# EAGLE board DUE3DOM_MINI_23052016-1301 (EAGLE 7.5.0)
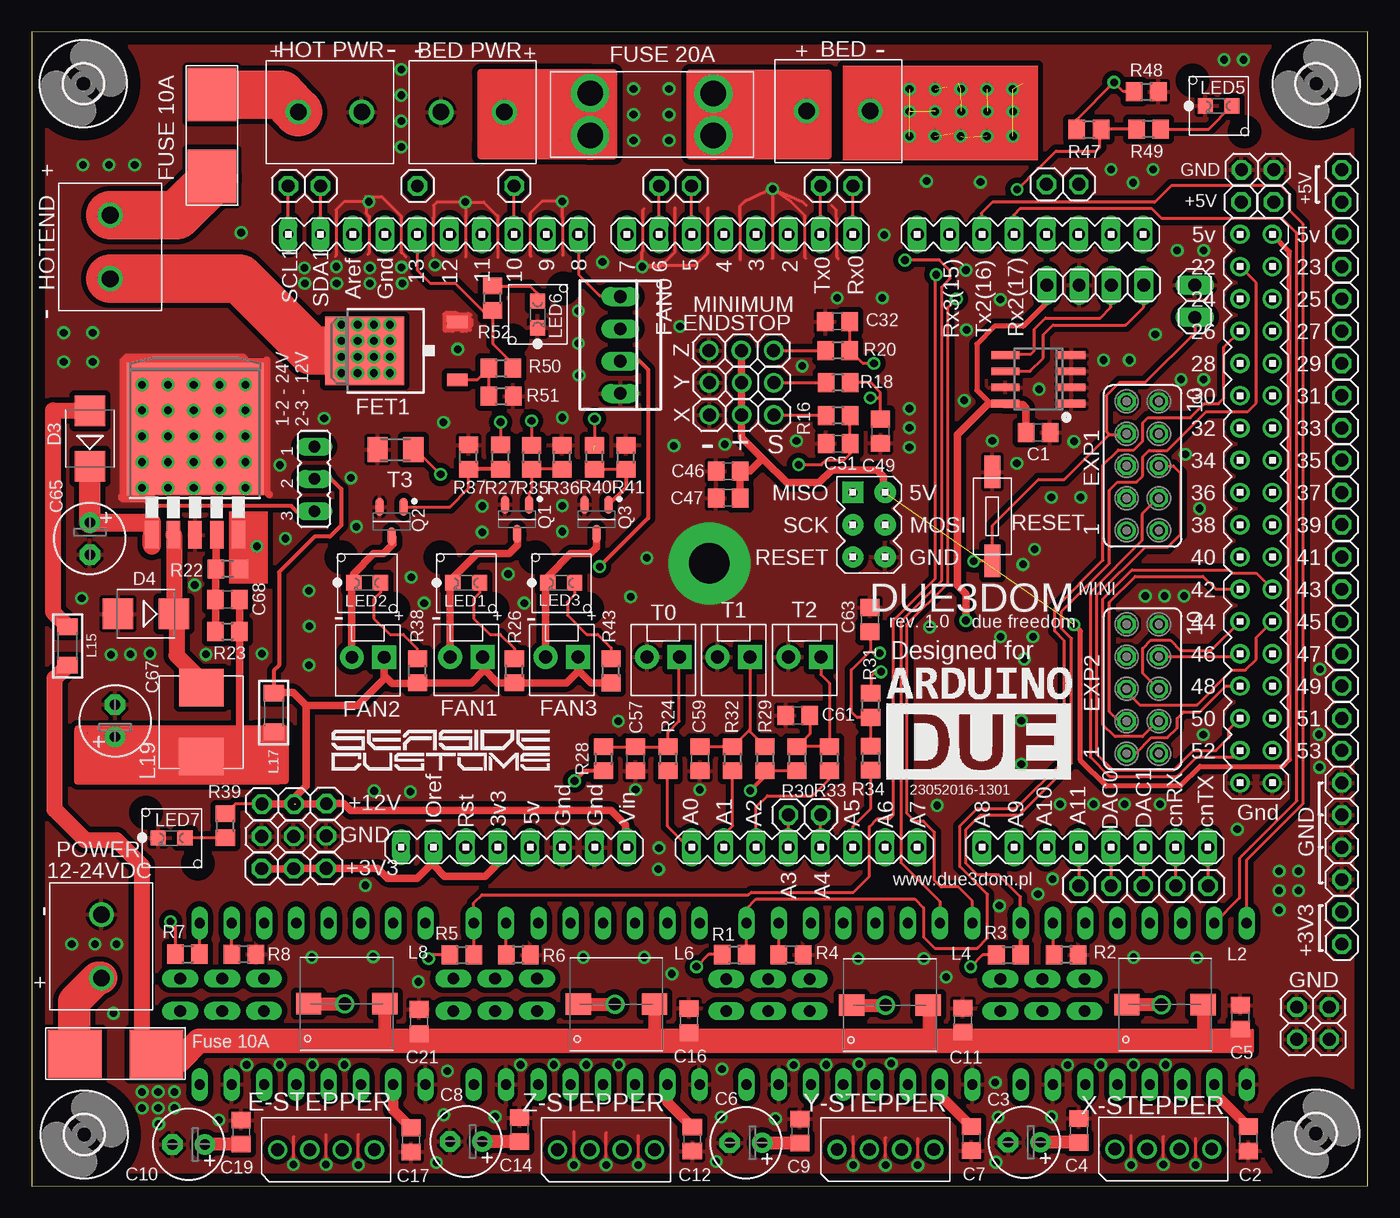
[diagram p3: board, top side]
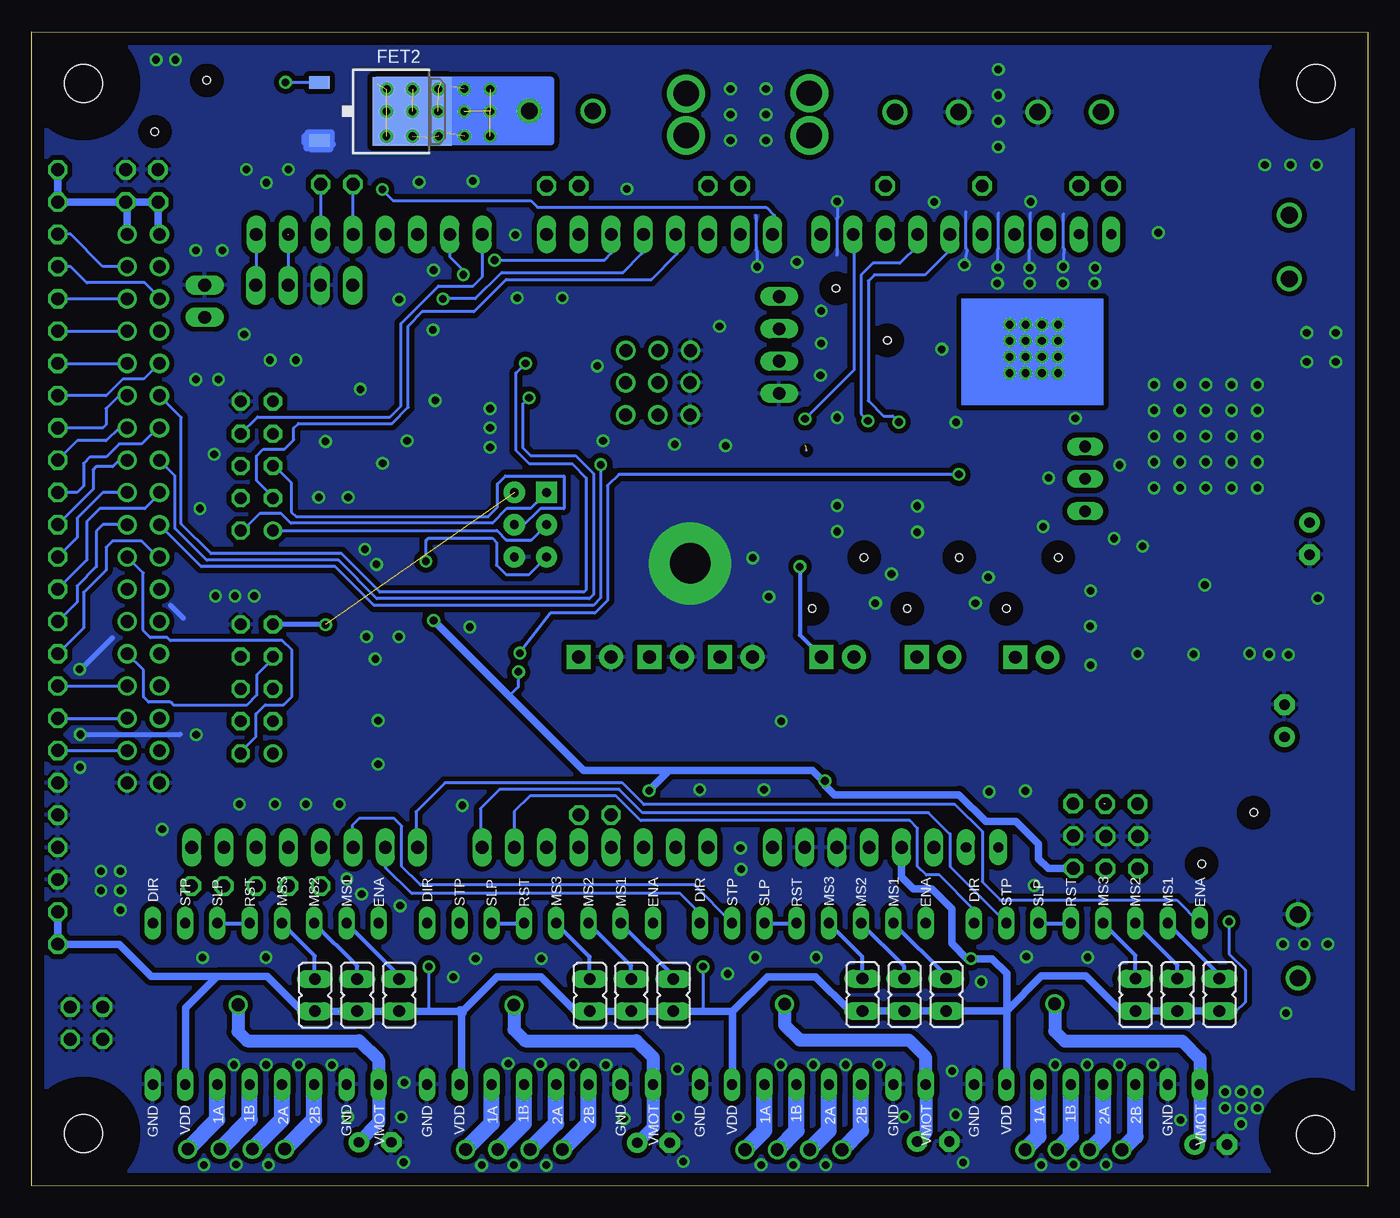
[diagram p4: board, bottom side, seen from below]

Size 105.17 x 90.88 mm. Coordinates in mm from the lower left corner, seen from the top.
Outline: 0,0 105.17,0.02 105.17,90.88 0,90.86 0,0
Copper layers (1*16): Top 0.035mm / dielectric 1.5mm / Bottom 0.035mm
Design rules "default *": minimum track width 10mil, minimum drill 23mil, track to track 8mil, track to pad 8mil, pad to pad 8mil, via to via 8mil, smd to smd 8mil, copper to edge 40mil, drill to drill 8mil, minimum pad ring 10mil, minimum via ring 8mil, stop-mask expansion 4mil, vias tented up to drill 24mil, thermal gap 10mil

## Footprints (pad centres in the part's own frame; a part is rotated, then mirrored left to right if it is on the bottom)
C0805 = smd 1.3 x 1.5: 1 -0.95,0; 2 0.95,0
E2,5-6 = drill 0.813 pad 1.6: + -1.27,0 | drill 0.813 pad 1.6 octagon: - 1.27,0
SMB = smd 2.4 x 2.4: A 2.2,0; C -2.2,0
DPAK_N-CHANNEL_MOSFET = smd 5.4 x 6.2: D 0,1.23 | smd 1 x 1.6: G -2.28,-6.07; S 2.28,-6.07
MOLEX-1X2 = drill 1.016 pad 1.88 square: 1 0,0 | drill 1.016 pad 1.88: 2 2.54,0
1X04 = drill 1.016 long: 1 -3.81,0; 2 -1.27,0; 3 1.27,0; 4 3.81,0
1X02 = drill 1.016 long: 1 -1.27,0; 2 1.27,0
3,0 = hole 3: 0,0
SO-08 = smd 0.6 x 2.2: 1 -1.905,-2.6; 2 -0.635,-2.6; 3 0.635,-2.6; 4 1.905,-2.6; 5 1.905,2.6; 6 0.635,2.6; 7 -0.635,2.6; 8 -1.905,2.6
TO263-5 = smd 1.067 x 2.159: 1 -3.404,-5.791; 2 -1.702,-5.791; 3 0,-5.791; 4 1.702,-5.791; 5 3.404,-5.791 | smd 10.8 x 10.41: 6 0,2.54
66100411622 = drill 1: 1 -5.08,0; 2 -2.54,0; 3 0,0; 4 2.54,0
1X01 = drill 1.016 octagon: 1 0,0
JP2 = drill 0.914 long: 1 -2.54,0; 2 0,0; 3 2.54,0
1X03 = drill 1.016: 1 -2.54,0; 2 0,0; 3 2.54,0
JP1 = drill 0.914 long: 1 0,-1.27; 2 0,1.27
WE-PD_7332/7345_PLASTIC_BASE = smd 1.7 x 2: 1 0,3; 2 0,-3
L1206 = smd 1.3 x 1.6: 1 -1.524,0; 2 1.524,0
WE-LHMI_7030/7050 = smd 2.95 x 3.5: 1 -2.725,0; 2 2.725,0
LED_0805_BIVAR_VLP-250-F = smd 1.2 x 1.2: A 0,-1.05; C 0,1.05 | hole 0.6: -2.032,-2.057; 2.007,2.032
691241710002 = drill 1.3: 1 -2.5,0; 2 2.5,0
SOT95P280X135-3N = smd 1.4 x 0.65: 1 -1.15,0.95; 2 -1.15,-0.95; 3 1.15,0
R0805 = smd 1.3 x 1.5: 1 -0.95,0; 2 0.95,0
WIDE_TACT = smd 2.54 x 1.27: 1 -3.5,0; 2 3.5,0
STEP-STICK = drill 0.8 long: 1A 3.81,-7.62; 1B 3.81,-5.08; 2A 3.81,-2.54; 2B 3.81,0; DIR -8.89,-12.7; ENABLE -8.89,5.08; GND 3.81,2.54; GND1 3.81,-12.7; MS1 -8.89,2.54; MS2 -8.89,0; MS3 -8.89,-2.54; RESET -8.89,-5.08; SLEEP -8.89,-7.62; STP -8.89,-10.16; VDD 3.81,-10.16; VMOT 3.81,5.08
FE05-2 = drill 0.914: 1 -5.08,1.27 | drill 0.914 octagon: 2 -5.08,-1.27; 3 -2.54,1.27; 4 -2.54,-1.27; 5 0,1.27; 6 0,-1.27; 7 2.54,1.27; 8 2.54,-1.27; 9 5.08,1.27; 10 5.08,-1.27
M1206 = smd 1.6 x 2: 1 -1.4,0; 2 1.4,0
DUE(NORMAL) = drill 1 long: 2 -16.51,30.48; 3 -19.05,30.48; 3V3 -39.37,-17.78; 4 -21.59,30.48; 5 -24.13,30.48; 5V -36.83,-17.78; 6 -26.67,30.48; 7 -29.21,30.48; 8 -33.02,30.48; 9 -35.56,30.48; 10 -38.1,30.48; 11 -40.64,30.48; 12 -43.18,30.48; 13 -45.72,30.48; A0 -24.13,-17.78; A1 -21.59,-17.78; A2 -19.05,-17.78; A3 -16.51,-17.78; A4 -13.97,-17.78; A5 -11.43,-17.78; A6 -8.89,-17.78; A7 -6.35,-17.78; A8 -1.27,-17.78; A9 1.27,-17.78; A10 3.81,-17.78; A11 6.35,-17.78; AREF -50.8,30.48; AREF1 -50.8,30.48; CANRX 13.97,-17.78; CANTX 16.51,-17.78; DAC0 8.89,-17.78; DAC1 11.43,-17.78; GND1 -48.26,30.48; GND_1 -34.29,-17.78; GND_2 -31.75,-17.78; RESET -41.91,-17.78; RX0 -11.43,30.48; RX1 6.35,30.48; RX2 1.27,30.48; RX3 -3.81,30.48; SCL 11.43,30.48; SDA 8.89,30.48; TX0 -13.97,30.48; TX1 3.81,30.48; TX2 -1.27,30.48; TX3 -6.35,30.48; VIN -29.21,-17.78 | drill 1: 5V_A 19.05,30.48; 5V_B 21.59,30.48; 22 19.05,27.94; 23 21.59,27.94; 24 19.05,25.4; 25 21.59,25.4; 26 19.05,22.86; 27 21.59,22.86; 28 19.05,20.32; 29 21.59,20.32; 30 19.05,17.78; 31 21.59,17.78; 32 19.05,15.24; 33 21.59,15.24; 34 19.05,12.7; 35 21.59,12.7; 36 19.05,10.16; 37 21.59,10.16; 38 19.05,7.62; 39 21.59,7.62; 40 19.05,5.08; 41 21.59,5.08; 42 19.05,2.54; 43 21.59,2.54; 44 19.05,0; 45 21.59,0; 46 19.05,-2.54; 47 21.59,-2.54; 48 19.05,-5.08; 49 21.59,-5.08; 50 19.05,-7.62; 51 21.59,-7.62; 52 19.05,-10.16; 53 21.59,-10.16; GND_A 19.05,-12.7; GND_B 21.59,-12.7 | drill 0.7 pad 1.676: 5V_ICSP -8.89,5.08; GND_ICSP -8.89,10.16; MOSI_ICSP -8.89,7.62; RESET_ICSP -11.43,5.08; SCK_ICSP -11.43,7.62 | drill 0.8 pad 1.422 long: IOREF -44.45,-17.78; NC -46.99,-17.78; SCL1 -55.88,30.48; SDA1 -53.34,30.48 | drill 0.7 pad 1.676 square: MISO_ICSP -11.43,10.16
FUSE_1808 = smd 4.24 x 3.81: 1 2.12,1.91; 2 8.57,1.9
KEYSTONE_3568 = drill 2: 1 3.124,5.029; 2 3.124,1.702; 3 12.827,5.004; 4 12.827,1.702
22-23-2041 = drill 1 long: 1 -3.81,0; 2 -1.27,0; 3 1.27,0; 4 3.81,0

## Placement (x,y rotation side)
C1  100nF  [C0805]  79.21,59.32 0 top
C2  100nF  [C0805]  95.77,3.72 270 top
C3  100uF 35V  [E2,5-6]  78.14,3.45 180 top
C4  100nF 50V  [C0805]  82.42,4.38 90 top
C5  100nF 50V  [C0805]  95.14,13.3 90 top
C6  100uF 35V  [E2,5-6]  56.22,3.41 180 top
C7  100nF  [C0805]  73.96,3.74 270 top
C8  100uF 35V  [E2,5-6]  34.2,3.51 180 top
C9  100nF 50V  [C0805]  60.49,4.34 90 top
C10  100uF 35V  [E2,5-6]  12.35,3.28 180 top
C11  100nF 50V  [C0805]  73.31,13.06 90 top
C12  100nF  [C0805]  51.99,3.7 270 top
C14  100nF 50V  [C0805]  38.4,4.44 90 top
C16  100nF 50V  [C0805]  51.73,13.03 90 top
C17  100nF  [C0805]  29.86,3.64 270 top
C19  100nF 50V  [C0805]  16.5,4.25 90 top
C21  100nF 50V  [C0805]  30.48,12.97 90 top
C32  100nF  [C0805]  63.42,68.07 0 top
C46  100nF  [C0805]  54.82,54.19 0 top
C47  1uF  [C0805]  54.81,56.28 0 top
C49  100nF  [C0805]  66.8,59.44 90 top
C51  100nF  [C0805]  63.47,58.45 0 top
C57  10uF  [C0805]  47.54,33.64 270 top
C59  10uF  [C0805]  52.6,33.64 270 top
C61  10uF  [C0805]  60.31,37.04 180 top
C63  10uF  [C0805]  65.99,44.6 90 top
C65  100uF 35V  [E2,5-6]  4.58,50.98 270 top
C67  100uF 35V  [E2,5-6]  6.56,36.64 90 top
C68  1nF  [C0805]  15.41,46.19 0 top
D3  B340B 3A 40V  [SMB]  4.58,58.85 90 top
D4  B340B 3A 40V  [SMB]  9,45.06 180 top
FET1  DPAK_N-CHANNEL_MOSFET  [DPAK_N-CHANNEL_MOSFET]  27.43,65.76 90 top
FET2  DPAK_N-CHANNEL_MOSFET  [DPAK_N-CHANNEL_MOSFET]  76.45,84.61 270 bottom
H13  FAN1  [MOLEX-1X2]  35.48,41.66 180 top
H14  FAN2  [MOLEX-1X2]  27.74,41.64 180 top
H15  FAN3  [MOLEX-1X2]  42.99,41.66 180 top
H16  I2C  [1X04]  83.72,70.92 0 top
H17  NTC1  [MOLEX-1X2]  50.97,41.66 180 top
H18  NTC2  [MOLEX-1X2]  56.53,41.66 180 top
H19  NTC3  [MOLEX-1X2]  62.11,41.66 180 top
H21  RST  [1X02]  91.55,69.66 270 top
H24  MOUNT-HOLE3.0  [3,0]  4.12,4.06 0 top
H25  MOUNT-HOLE3.0  [3,0]  101.09,4.14 0 top
H26  MOUNT-HOLE3.0  [3,0]  4.06,86.79 0 top
H28  MOUNT-HOLE3.0  [3,0]  101.1,86.79 0 top
IC2  24LC256SN  [SO-08]  79.24,63.51 90 top
IC5  LM2596S  [TO263-5]  12.86,57.07 0 top
J1  X-MOT  [66100411622]  87.8,2.91 180 top
J2  Y-MOT  [66100411622]  65.93,2.89 180 top
J3  Z-MOT  [66100411622]  43.94,2.86 180 top
J4  E-MOT  [66100411622]  21.89,2.86 180 top
JP1  [1X01]  95.2,77.47 180 top
JP2  [1X01]  103.12,59.69 0 top
JP3  [1X01]  103.12,64.77 0 top
JP4  [1X01]  103.12,67.31 0 top
JP5  [1X01]  103.12,69.85 0 top
JP6  [1X01]  20.19,78.74 0 top
JP7  12/24  [JP2]  22.24,55.68 270 top
JP8  X-MIN  [1X03]  55.88,60.71 0 top
JP9  [JP1]  11.68,15.06 0 bottom
JP10  Y-MIN  [1X03]  55.88,63.25 0 top
JP11  [JP1]  14.99,15.06 0 bottom
JP12  Z-MIN  [1X03]  55.85,65.79 0 top
JP13  [JP1]  18.29,15.06 0 bottom
JP14  [1X01]  22.73,78.74 0 top
JP15  [1X01]  62.1,78.74 0 top
JP16  [1X01]  64.64,78.74 0 top
JP17  [1X01]  79.88,78.87 0 top
JP18  [1X01]  82.42,78.87 0 top
JP19  [1X01]  30.35,78.74 0 top
JP20  [1X01]  49.39,78.74 0 top
JP21  [1X01]  37.97,78.74 0 top
JP22  [1X01]  103.12,49.53 0 top
JP23  [1X01]  18.11,30.08 0 top
JP24  [1X01]  97.76,77.47 180 top
JP25  [1X01]  51.93,78.74 0 top
JP26  [1X01]  92.61,23.62 180 top
JP27  [1X01]  103.12,41.91 0 top
JP28  [1X01]  103.12,52.07 0 top
JP29  [1X01]  103.12,57.15 0 top
JP30  [1X01]  103.12,77.47 180 top
JP31  [1X01]  20.65,30.08 0 top
JP32  [1X01]  23.19,30.11 0 top
JP33  [1X01]  103.12,31.75 270 top
JP34  [1X01]  103.12,24.13 270 top
JP35  [1X01]  102.13,11.56 270 top
JP36  [1X01]  99.59,11.56 270 top
JP37  [1X01]  103.12,29.21 270 top
JP38  [1X01]  102.13,14.1 180 top
JP39  [1X01]  103.12,26.67 270 top
JP40  [1X01]  99.59,14.1 0 top
JP41  [1X01]  97.76,80.01 0 top
JP42  [1X01]  95.23,80.01 0 top
JP43  [1X01]  20.63,27.53 0 top
JP44  [1X01]  18.09,27.54 0 top
JP45  [1X01]  23.18,27.57 0 top
JP46  [JP1]  33.17,15.06 0 bottom
JP47  [JP1]  36.47,15.06 0 bottom
JP48  [JP1]  39.78,15.06 0 bottom
JP49  [JP1]  54.66,15.04 0 bottom
JP50  [JP1]  57.99,15.04 0 bottom
JP51  [JP1]  61.24,15.04 0 bottom
JP52  [1X01]  90.04,23.62 180 top
JP53  [1X01]  84.96,23.62 180 top
JP54  [1X01]  87.5,23.62 180 top
JP55  [JP1]  76.25,15.04 0 bottom
JP56  [JP1]  79.55,15.04 0 bottom
JP57  [JP1]  82.88,15.04 0 bottom
JP58  [1X01]  18.08,24.99 0 top
JP59  [1X01]  20.62,24.99 0 top
JP60  [1X01]  23.16,25.02 0 top
JP61  [1X01]  103.12,80.01 0 top
JP62  [1X01]  103.12,62.23 0 top
JP63  [1X01]  103.12,54.61 0 top
JP64  [1X01]  103.12,46.99 0 top
JP65  [1X01]  103.12,44.45 0 top
JP66  [1X01]  103.12,39.37 0 top
JP67  [1X01]  103.12,36.83 0 top
JP68  [1X01]  103.12,34.29 0 top
JP69  [1X01]  59.56,29.21 0 top
JP70  [1X01]  62.1,29.21 0 top
JP71  [1X01]  82.42,23.62 0 top
JP72  [1X01]  103.12,74.93 0 top
JP73  [1X01]  103.12,72.39 0 top
JP74  [1X01]  103.12,21.59 0 top
JP75  [1X01]  103.12,19.05 0 top
L2  8.2uH 2.7A  [WE-PD_7332/7345_PLASTIC_BASE]  89.2,14.29 90 top
L4  8.2uH 2.7A  [WE-PD_7332/7345_PLASTIC_BASE]  67.56,14.25 90 top
L6  8.2uH 2.7A  [WE-PD_7332/7345_PLASTIC_BASE]  46.02,14.32 90 top
L8  8.2uH 2.7A  [WE-PD_7332/7345_PLASTIC_BASE]  24.79,14.36 90 top
L15  600R 2A  [L1206]  2.81,42.52 90 top
L17  600R 2A  [L1206]  19.06,37.28 90 top
L19  33uH 1.9A 0.2R WE-LHMI  [WE-LHMI_7030/7050]  13.34,36.53 270 top
LED1  LED1  [LED_0805_BIVAR_VLP-250-F]  34.2,47.49 90 top
LED2  LED2  [LED_0805_BIVAR_VLP-250-F]  26.4,47.49 90 top
LED3  LED3  [LED_0805_BIVAR_VLP-250-F]  41.68,47.49 90 top
LED5  HOT2 LED  [LED_0805_BIVAR_VLP-250-F]  93.42,85.04 90 top
LED6  BED LED  [LED_0805_BIVAR_VLP-250-F]  39.82,68.62 180 top
LED7  POWER LED  [LED_0805_BIVAR_VLP-250-F]  11.01,27.41 90 top
P2  BED PWR  [691241710002]  34.71,84.55 180 top
P3  BED  [691241710002]  63.49,84.64 0 top
P4  HOTEND  [691241710002]  6.18,73.94 270 top
P5  HOT PWR  [691241710002]  23.47,84.56 0 top
P7  POWER  [691241710002]  5.48,18.88 90 top
Q1  IRLML0030TRPBF  [SOT95P280X135-3N]  38.2,52.49 270 top
Q2  IRLML0030TRPBF  [SOT95P280X135-3N]  28.33,52.32 270 top
Q3  IRLML0030TRPBF  [SOT95P280X135-3N]  44.47,52.49 270 top
R1  100K  [R0805]  55.31,18.23 0 top
R2  100K  [R0805]  81.43,18.22 180 top
R3  100K  [R0805]  76.88,18.2 0 top
R4  100K  [R0805]  59.76,18.22 180 top
R5  100K  [R0805]  33.85,18.21 0 top
R6  100K  [R0805]  38.29,18.2 180 top
R7  100K  [R0805]  12.26,18.27 0 top
R8  100K  [R0805]  16.7,18.26 180 top
R16  10K  [R0805]  63.47,60.66 180 top
R18  10K  [R0805]  63.47,63.25 180 top
R20  10K  [R0805]  63.45,65.79 180 top
R22  1K  [R0805]  15.43,48.57 180 top
R23  8K7  [R0805]  15.41,43.67 0 top
R24  100R  [R0805]  50.08,33.64 270 top
R26  2K7  [R0805]  37.99,40.57 90 top
R27  100R  [R0805]  36.9,57.4 90 top
R28  4K7  [R0805]  45,33.64 270 top
R29  4K7  [R0805]  57.72,33.64 270 top
R30  4K7  [R0805]  60.24,33.64 270 top
R31  4K7  [R0805]  66.04,37.85 90 top
R32  100R  [R0805]  55.16,33.64 270 top
R33  100R  [R0805]  62.78,33.64 270 top
R34  100R  [R0805]  66.04,33.68 270 top
R35  100R  [R0805]  39.35,57.39 90 top
R36  10K  [R0805]  41.75,57.39 90 top
R37  10K  [R0805]  34.37,57.4 90 top
R38  2K7  [R0805]  30.36,40.57 90 top
R39  2K7  [R0805]  15.25,28.37 90 top
R40  100R  [R0805]  44.29,57.38 90 top
R41  10K  [R0805]  46.77,57.37 90 top
R43  2K7  [R0805]  45.59,40.56 90 top
R47  100R  [R0805]  83.21,83.19 0 top
R48  10K  [R0805]  87.73,86.16 0 top
R49  470R  [R0805]  87.91,83.21 180 top
R50  100R  [R0805]  36.93,64.39 0 top
R51  10K  [R0805]  36.95,62.21 0 top
R52  470R  [R0805]  36.27,69.91 90 top
RESET  RESET  [WIDE_TACT]  75.61,52.73 90 top
STEPSTICK-X  STEP-STICK  [STEP-STICK]  82.93,11.81 270 bottom
STEPSTICK-Y  STEP-STICK  [STEP-STICK]  61.34,11.81 270 bottom
STEPSTICK-Z1  STEP-STICK  [STEP-STICK]  39.88,11.81 270 bottom
STEPSTICK-Z2  STEP-STICK  [STEP-STICK]  18.29,11.81 270 bottom
SV4  EXP2  [FE05-2]  87.45,39.14 90 top
SV5  EXP1  [FE05-2]  87.45,56.69 90 top
THERMISTOR  NTC100K  [M1206]  28.63,57.99 180 top
U$1  DUE(NORMAL)  [DUE(NORMAL)]  76.07,44.45 0 top
U$2  FUSE_1808  [FUSE_1808]  16.08,77.37 90 top
U$3  FUSE_1808  [FUSE_1808]  11.94,12.32 180 top
U$13  KEYSTONE_3568  [KEYSTONE_3568]  40.83,81.01 0 top
X1  22-23-2041  [22-23-2041]  46.33,66.22 270 top

## Tracks (layer width: path | path; a pad name or v marks a point on that pad's centre or on a via)
25
  Bottom 0.254: JP5.1 U$1.25
27
  Bottom 0.254: JP4.1 U$1.27
29
  Bottom 0.254: JP3.1 U$1.29
31
  Bottom 0.254: U$1.31 98.3,62.23 99.31,61.21 99.31,59.94 99.57,59.69 JP2.1
33
  Bottom 0.254: U$1.33 98.3,59.69 99.31,58.67 101.6,58.67 JP29.1
35
  Bottom 0.254: U$1.35 98.3,57.15 98.81,56.64 100.08,56.64 100.33,56.39 100.33,54.86 JP28.1
37
  Bottom 0.254: U$1.37 99.57,54.61 101.6,52.58 101.6,51.05 JP22.1
+3V3  (via drill 0.6)
  Top 0.254: R30.2 R29.2 | R3.1 74.84,18.2 v73.91,17.27 | R1.1 53.28,18.23 v52.32,17.27 | R5.1 31.54,18.21 v31.24,17.91 | R7.1 11.31,20.44 v10.92,20.83 | v66.85,40.49 66.4,40.49 66.04,40.13 R31.2
  Top 0.305: R28.2 43.51,32.69 v42.72,31.9 | R29.2 57.72,32.29 v56.57,31.14
  Top 0.406: H16.1 79.91,69.55 78.05,67.69 75.79,67.69 74.4,66.29 74.4,62.66 75.54,61.52 76.55,61.52 IC2.8
  Top 0.61: U$1.IOREF 31.62,25.53 | 31.62,25.53 31.62,25.28 32.51,24.38 35.68,24.38 36.7,25.4 U$1.3V3 | 31.62,25.53 30.32,24.23 28.02,24.23 27.23,25.02 JP60.1 20.65,25.02 JP59.1 JP58.1 | v73.53,44.53 73.53,46.61 72.87,47.27 72.87,59.18 75.26,61.57 76.6,61.57 IC2.8 | 76.55,61.52 78,61.52 78.26,61.27 C1.1
  Top 0.813: C17.1 28.45,6 STEPSTICK-Z2.VDD | C12.1 50.04,6.61 STEPSTICK-Z1.VDD | C7.1 71.5,7.15 STEPSTICK-Y.VDD | C2.1 93.09,7.35 STEPSTICK-X.VDD
  Bottom 0.254: v73.91,17.27 73.91,13.77 | v52.32,17.27 52.32,13.77 | v10.92,20.83 10.92,18.29 9.65,17.02 9.65,14.48 10.41,13.72 11.61,13.72 JP9.1 | v66.85,40.49 66.88,39.29 67.59,38.58
  Bottom 0.61: U$1.3V3 36.7,24.33 35.76,23.39 34.29,23.39 32.74,21.84 32.74,19.1 31.55,17.91 v31.24,17.91 29.59,17.91 28.42,16.74 28.42,13.79 | JP9.1 JP11.1 JP13.1 19.43,13.79 22.17,16.54 25.68,16.54 28.42,13.79 | JP48.1 JP47.1 JP46.1 28.42,13.79 | 40.77,13.79 43.46,16.48 47.27,16.48 49.99,13.77 | 71.35,8.15 71.35,13.69 68.56,16.48 65.08,16.48 62.36,13.77 JP51.1 JP50.1 JP49.1 52.32,13.77 49.99,13.77 | 71.42,13.77 73.91,13.77 JP55.1 JP56.1 JP57.1 | 83.9,13.77 86.64,16.51 90.58,16.51 | 90.58,16.51 93.07,14.02 93.07,8.03 | 49.99,13.77 49.99,8.05 | 28.42,13.79 28.42,8.03 | 54.99,32.72 43.71,32.72 42.9,31.9 v42.72,31.9 42.72,31.55 41.99,30.81 32.18,30.81 30.07,28.7 27.69,28.7 25.91,26.92 25.91,25.78 25.15,25.02 JP60.1 | 54.99,32.72 v56.57,31.14 | 54.99,32.72 61.72,32.72 67.59,38.58 v73.53,44.53 | JP74.1 JP75.1 98.3,19.05 95.76,16.51 90.58,16.51
  Bottom 0.813: JP48.1 40.77,13.79 | 71.35,8.15 STEPSTICK-Y.VDD | 71.42,13.77 71.35,13.69 | JP57.1 83.9,13.77 | 93.07,8.03 STEPSTICK-X.VDD | 49.99,8.05 STEPSTICK-Z1.VDD | 28.42,8.03 STEPSTICK-Z2.VDD
  Bottom 1.016: 28.47,8.03 STEPSTICK-Z2.VDD
+5V  (via drill 0.6)  (1 unrouted)
  Top 0.406: U$1.5V_B 99.01,73.58 99.01,33.58 98.48,33.05 91.97,33.05 90.42,31.5 84.58,31.5 82.55,33.53 82.55,43.69 v82.04,44.2
  Top 0.61: U$1.GND_ICSP 67.06,54.73 67.06,55.88 66.55,56.39 62.99,56.39 61.98,55.37 59.44,55.37 57.53,57.28 | JP12.2 55.85,63.27 JP10.2 JP8.2 55.88,58.93 57.53,57.28 | C46.2 C47.2 56.53,56.28 57.53,57.28
  Bottom 0.406: v82.04,44.2 86.16,44.2 SV4.9
  Bottom 0.61: JP24.1 JP1.1 95.2,75.01 U$1.5V_A | JP24.1 97.79,77.44 103.07,77.44 JP30.1 JP61.1 | U$1.5V_B 97.66,77.36 JP24.1 | 67.06,54.73 U$1.GND_ICSP
+12V  (via drill 0.6)  (1 unrouted)
  Top 0.254: JP23.1 16.01,30.08 R39.2
  Top 0.305: L17.2 19.04,38.8 | 19.3,38.61 19.25,38.61 L17.2 | X1.3 45.62,65.02 47.75,65.02 48.51,64.26 48.51,52.58 v44.7,48.77 | L17.2 19.05,38.81 19.05,40.59 19.46,41 19.46,48.34 22.25,51.13 23.47,51.13 24.36,52.02 24.36,54.89 23.37,55.88 22.44,55.88 JP7.2
  Top 0.61: U$1.VIN 46.74,26.79 46.74,28.45 45.61,29.57 25.11,29.57 24.56,30.12 23.21,30.12 JP32.1 23.16,30.08 JP31.1 JP23.1 | L17.2 19.12,38.86 20.57,38.86 21.59,37.85 | 20.76,30.11 20.76,30.67 21.59,31.5 21.59,37.85 | 21.59,37.85 25.65,37.85 27.74,39.93 H14.1 27.74,40.21 28.37,39.57 30.31,39.57 R38.1 34.62,39.62 35.53,40.54 35.53,41.61 H13.1 35.48,40.82 36.68,39.62 37.98,39.62 R26.1 42.08,39.62 43.03,40.56 43.03,41.62 H15.1 42.99,40.65 44.02,39.62 45.58,39.62 R43.1
  Bottom 0.305: v44.7,48.77 44.7,43.38 H15.1
+24V
  Top 0.254: 94.16,11.43 94.16,12.14 94.03,12.27 96.09,12.27 96.09,11.48 | 96.09,11.48 96.09,10.64 | 96.09,10.64 94.97,10.64 94.97,10.69 94.92,10.69 94.92,10.59 96.09,10.59 96.09,10.64 | 96.09,11.48 95.89,11.48 | 95.89,11.48 95.89,10.82 95.68,10.82 | 95.89,11.48 95.89,12.09 95.14,12.09 C5.1 | C21.1 28.96,12.02 28.96,11.43
  Top 0.305: C11.1 72.82,12.11 72.14,11.43
  Top 1.016: L8.2 27.79,11.54 | L6.2 49.02,11.69 | L2.2 92.2,11.68 | L4.2 70.64,14.25 70.64,11.43
  Top 1.27: 49.02,11.69 49.28,11.43 | C16.1 51.86,11.72 51.56,11.43 | 92.2,11.68 92.46,11.43 | 95.14,11.57 95,11.43 | U$3.1 8.66,11.57 8.66,25.25 6.66,27.25 4.19,27.25 1.8,29.65 1.8,39.98 L15.1
  Top 1.422: 8.61,11.62 U$3.1
  Top 1.676: 27.79,11.54 27.69,11.43
  Top 1.778: 11.63,9.91 10.47,9.91 U$3.1
  Top 1.93: 95,11.43 94.16,11.43 92.46,11.43 72.14,11.43 70.64,11.43 51.56,11.43 49.28,11.43 28.96,11.43 27.69,11.43 13.16,11.43 11.63,9.91
BED  (via drill 0.6)
  Top 0.254: v77.57,78.46 79.2,80.09 79.2,80.11 79.25,80.11 80.62,81.48 83.77,81.48 84.07,81.79 84.07,83.1 R47.2 84.19,83.21 R49.2
  Bottom 0.254: v77.57,78.46 77.57,78.44 76.71,77.57 65.86,77.57 65.35,77.06 47.35,77.06 46.74,76.45 46.74,75.05 U$1.7
BEEPER
  Bottom 0.254: 88.67,34.06 SV4.2 88.72,34.16 87.5,35.38 87.5,37.19 86.79,37.9 85.34,37.9 84.68,38.56 84.68,42.19 85.45,42.95 94.26,42.95 94.49,43.18 95.83,43.18 96.39,43.74 96.39,48.27 U$1.41
CANRX
  Top 0.254: U$1.CANRX JP52.1
  Bottom 0.254: JP52.1
CANTX
  Top 0.254: U$1.CANTX 92.58,23.65 JP26.1
CARDDETECT
  Top 0.254: 69.67,74.97 U$1.TX3
  Bottom 0.254: SV5.8 87.4,60.55 76.96,60.55 76.1,61.42 76.1,67.92 73.15,70.87 70.43,70.87 69.7,71.6 69.7,74.91 U$1.TX3 | U$1.TX3 | U$1.TX3
CS0
  Top 0.254: U$1.10 JP21.1
  Bottom 0.254: JP21.1
CS1
  Top 0.254: 54.41,74.86 U$1.4
  Bottom 0.254: SV5.3 86.18,54.25 87.48,55.55 87.48,57.48 86.94,58.01 85.27,58.01 84.53,58.75 84.53,59.69 84.18,60.05 76.81,60.05 75.54,61.32 75.54,67.72 74.42,68.83 70.36,68.83 67.82,71.37 56.39,71.37 54.36,73.41 54.36,74.81 U$1.4 | U$1.4 | 54.38,74.83 U$1.4
DAC0
  Top 0.254: U$1.DAC0 JP53.1
  Bottom 0.254: JP53.1
DAC1
  Top 0.254: U$1.DAC1 JP54.1
  Bottom 0.254: JP54.1
E-DIR
  Bottom 0.254: STEPSTICK-Z2.DIR 30.99,21.77 33.71,24.49 34.75,24.49 35.43,25.17 35.43,28.17 36.04,28.78 57.23,28.78 59.18,30.73 65.94,30.73 67.18,29.49 U$1.A6
E-ENA
  Top 0.254: R7.2 STEPSTICK-Z2.ENABLE
  Bottom 0.254: STEPSTICK-Z2.ENABLE 15.04,22.53 28.93,22.53 30.35,23.95 30.35,27.91 32.49,30.05 56.97,30.05 58.67,31.75 72.64,31.75 74.93,29.46 74.93,26.8 U$1.A8
E-STP
  Bottom 0.254: STEPSTICK-Z2.STP 28.45,20.73 32.87,25.15 32.87,27.74 32.92,27.74 34.57,29.39 57.07,29.39 58.93,31.24 68.33,31.24 69.85,29.72 69.85,26.8 U$1.A7 69.7,26.69
ENCA
  Top 0.254: SV5.4 88.65,54.15 87.4,52.91 87.4,50.83 83.31,46.74 83.31,33.78 84.84,32.26 90.17,32.26 91.69,33.78 94.61,33.78 U$1.52
ENCB
  Top 0.254: SV5.6 89.86,56.69 90.42,56.13 90.42,51.31 89.41,50.29 87.63,50.29 83.82,46.48 83.82,34.04 85.09,32.77 89.92,32.77 91.44,34.29 93.22,34.29 94.23,35.31 94.23,35.95 U$1.50
ENCP
  Top 0.254: SV4.1 86.89,34.06 88.14,35.31 89.41,35.31 90.17,36.07 90.17,36.83 90.68,37.34 91.95,37.34 93.98,39.37 U$1.48
FAN0
  Top 0.254: U$1.8 43.05,71.76 44.7,70.1 46.25,70.1 X1.1
FAN1  (via drill 0.6)
  Top 0.254: v39.34,60.25 R35.2
  Bottom 0.254: U$1.11 35.43,74.05 36.83,72.64 38.96,72.64 39.88,71.73 39.88,60.78 v39.34,60.25
FAN2  (via drill 0.6)
  Top 0.254: v36.91,60.15 R27.2
  Bottom 0.254: U$1.12 32.87,74.91 32.87,73.74 34.87,71.73 38.84,71.73 39.32,71.25 39.32,61.82 38.12,60.63 37.39,60.63 v36.91,60.15
FAN3  (via drill 0.6)  (1 unrouted)
  Top 0.254: v44.3,60.4 44.3,58.34 R40.2
  Bottom 0.254: 44.2,57.91 44.2,57.94 | U$1.9 40.46,74.89 40.46,64.24 v44.3,60.4
GND  (via drill 0.6, 3.2 pad 6.45)
  Top 0.254: v91.62,1.68 91.62,3.73 | v89.08,1.7 89.08,3.91 | v86.54,1.68 86.54,3.99 | v69.75,1.65 69.75,3.76 | v67.21,1.65 67.21,3.83 | v64.67,1.65 64.67,3.89 | v47.75,1.68 47.75,3.99 | v45.21,1.68 45.21,4.22 | v42.67,1.68 42.67,4.32 | v25.7,1.68 25.7,4.06 | v23.16,1.7 23.16,4.06 | v20.6,1.7 20.62,1.7 20.62,3.91 | 26.31,77.9 v26.54,77.5 24.59,77.5 23.95,76.86 23.95,73.25 23.9,73.2 | 26.31,77.9 26.31,76.58 26.57,76.33 26.57,73.51 26.52,73.46 26.52,73.41 26.47,73.36 | 26.31,77.9 27.53,77.9 29.08,76.35 29.08,73.51 29.11,73.48 29.13,73.48 29.46,73.15 | v34.14,77.47 31.9,77.47 31.62,77.19 31.62,76.28 31.6,76.25 31.6,73.25 31.62,73.23 31.6,73.23 | v34.14,77.47 34.14,76.33 34.16,76.3 34.16,73.15 | v34.14,77.47 35.59,77.47 36.68,76.38 36.68,73.1 | 39.29,73.2 39.22,73.28 39.22,76.17 39.24,76.2 39.24,76.58 40.18,77.52 v41.76,77.52 41.76,76.28 41.78,76.25 41.78,73.25 | 48.06,72.49 v48.06,72.39 49.51,72.39 50.65,73.53 50.65,76.99 50.62,77.01 | 48.06,72.49 48.06,73.53 48.13,73.61 48.13,76.89 48.18,76.94 | 48.06,72.49 52.25,72.49 53.21,73.46 53.21,76.96 53.26,77.01 | v58.32,78.51 56.11,77.5 55.73,77.11 55.73,76.28 55.75,76.25 55.75,72.92 | v58.32,78.51 58.32,76.22 58.29,76.2 58.29,73.05 58.32,73.03 | v58.32,78.51 59.77,77.5 60.83,76.43 60.83,73.13 60.91,73.05 | v58.32,78.51 60.68,77.5 60.96,77.22 | 62.97,77.22 63.32,76.86 63.32,76.22 63.35,76.2 63.35,73.15 63.5,73 63.48,73 | 34.57,68.05 34.52,68.05 34.29,67.82 34.29,68.33 33.02,68.33 32.77,68.07 32.77,67.82
  Top 0.305: 33.48,68.71 33.53,68.66 34.31,68.66 34.34,68.63 34.47,68.63 34.52,68.58 34.49,68.58 34.34,68.43 34.39,68.43 34.57,68.25 34.57,68.05 34.57,67.74 34.49,67.67 34.39,67.67 34.37,67.64 34.37,67.51 34.47,67.41 34.29,67.41 34.21,67.33 34.21,67.49 34.19,67.51 34.09,67.51 34.04,67.46 34.04,67.39 33.96,67.31 33.88,67.31 33.86,67.33 33.86,67.41 33.83,67.44 33.22,67.44 33.2,67.46 33.2,67.39 33.15,67.33 32.56,67.33 32.51,67.39 32.51,67.54 33.05,67.54 33.07,67.51 33.05,67.51 32.92,67.64 32.51,67.64 32.51,68.07 | 32.51,68.07 32.51,68.58 32.46,68.63 32.51,68.63 32.64,68.76 33.33,68.76 33.33,68.66 33.2,68.53 32.72,68.53 32.69,68.5 32.69,68.28 32.64,68.22 32.64,68.2 32.51,68.07
  Top 0.406: v17.73,50.37 16.26,50.37 16.26,50.55
  Top 0.61: IC5.5 16.26,50.55 16.26,48.69 R22.1 | v16.82,63.09 16.82,64.97 16.51,65.28 16.59,65.28 16.94,64.92 18.39,64.92 18.49,65.02 18.49,54.63 18.69,54.43
  Top 0.813: v8.69,63.09 14.48,63.09 16.54,65.15 7.57,65.15 7.32,64.9 7.32,54.33 7.21,54.23 8.99,54.23 9.09,54.13 9.09,54.18 9.3,54.38 8.08,54.38 7.82,54.63 7.82,64.39 7.87,64.44 15.16,64.44 15.34,64.62 15.34,64.67 15.24,64.77
  Bottom 0.254: v23.98,72.39 23.88,73.76 23.95,73.84 23.95,76.53 | v26.62,72.29 26.62,73.74 26.54,73.81 26.54,76.61 26.52,76.63 | v29.11,72.34 29.11,73.76 29.06,73.81 29.06,76.61 | v31.75,72.52 31.52,73.69 31.62,73.79 31.62,76.68 31.65,76.71 | v41.76,77.52 41.76,76.2 41.78,76.17 41.78,73.28 | v48.06,72.39 48.06,73.58 48.13,73.66 48.13,76.38 48.16,76.4
  Bottom 0.406: v101.35,35.56 93.47,35.56 | v101.4,40.69 101.3,40.69 98.81,43.18 | 93.22,44.7 94.23,45.72
  Bottom 0.61: FET2.S 81.71,82.33 81.58,82.45 81.58,82.88 83.41,82.88 83.41,81.81 83.49,81.74 83.49,82.45 83.64,82.6 83.64,82.19 83.13,81.69 81.71,81.69 81.71,81.81 81.51,82.02 82.02,82.02 82.3,82.3
  other vias: 11.23,7.42 22.05,18.01 26.87,18.06 43.41,18.01 65.05,17.91 70.23,17.91 71.98,16.46 50.39,16.71 30.43,16.08 9.3,41.94 7.77,41.86 6.25,41.83 3.94,46.28 86.74,18.01 91.72,17.98 10.72,63.09 12.75,63.09 14.78,63.09 16.81,61.06 14.78,61.06 12.75,61.06 10.72,61.06 8.69,61.06 8.69,59.03 10.72,59.03 12.75,59.03 14.78,59.03 16.81,59.03 16.81,57 14.78,57 12.75,57 10.72,57 8.69,57 8.69,54.97 10.72,54.97 12.75,54.97 14.78,54.97 16.81,54.97 79.3,62.74 6.43,13.61 3.15,19.05 4.98,19.05 6.68,19.05 14.73,5.21 32.44,5.61 31.85,1.85 32.72,9.07 9.98,4.9 36.47,5.46 54.28,5.44 54.33,9.22 48.21,18.01 75.84,8.15 76.07,5.44 75.9,1.88 53.87,1.93 80.29,5.46 67.67,9.65 65.13,9.6 62.53,9.55 24.61,9.55 46.2,9.55 43.64,9.55 41.1,9.55 22.1,9.55 19.53,9.55 16.92,9.55 38.48,9.55 59.97,9.53 58.55,5.31 81.53,9.53 84.15,9.55 86.72,9.55 89.26,9.55 75.62,58.67 78.03,48.95 94.89,28.09 79.2,22.99 80.37,24.18 76.17,22.07 47.52,31.22 52.58,31.22 49.33,24.94 82.04,58.62 18.11,41.91 33.53,65.89 25.12,55.75 74.68,79.04 26.26,23.67 69.09,58.17 60.66,64.57 69.09,59.69 69.09,61.21 73.53,72.11 63.4,69.93 73.41,61.85 73.58,67.41 76.25,69.8 82.58,54.23 80.26,54.23 90.81,57.61 91.92,53.34 71.27,29.97 70.69,44.02 29.79,31.04 46.18,36.6 26.95,31.11 13.72,41.86 12.83,47.32 9.96,7.42 8.69,7.42 8.69,6.15 9.96,6.15 11.23,6.15 54.56,58.39 53.34,49.02 101.37,32.97 92.25,63.5 87.66,46.46 89.18,46.46 90.7,46.46 92.23,35.53 78.82,43.26 76.28,43.26 77.9,36.65 77.9,33.22 83.59,30.07 86.03,30.07 80.95,30.07 88.82,30.07 98.2,24.79 98.2,23.27 98.2,21.74 99.72,24.79 99.72,23.27 44.93,72.75 21.46,72.29 26.62,71.07 24,71.07 29.16,71.07 21.49,71.07 35.46,53.54 41.76,53.57 41.76,51.54 35.46,51.49 21.82,46.86 49.38,26.62 78.13,41.5 78.94,50.14 77.55,56.9 90.17,73.66 86.69,78.99 67.11,74.88 70.43,79.12 23.01,60.45 50.55,58.29 19.53,56.77 43.03,68.91 43.03,66.34 51.03,67.69 60.2,58.67 90.47,63.5 88.44,67.06 86.41,65.02 84.38,65.02 92.25,73.66 21.82,41.02 25.55,51.92 37.49,48.18 38.76,45.9 29.87,47.93 30.89,45.9 47.14,46.41 48.41,49.45 32.41,60.12 19.96,50.98 21.84,44.07 41.76,60.5 4.8,64.9 4.8,67.18 2.51,67.18 2.51,64.9 6.07,80.39 4.04,80.39 16.48,75.06 8.1,80.39 29.08,87.91 29.08,85.88 29.08,83.85 29.08,81.81 47.37,86.39 47.37,84.35 47.37,82.32 50.16,86.39 50.16,84.35 50.16,82.32 93.85,88.67 95.38,88.67 88.27,80.04 84.96,80.04 66.95,69.93 43.08,63.83
  pour Top (isolate 0.406): 1.02,-1.27 0.18,-1.27 0.18,91.14 106.17,91.14 106.17,-0.89 1.07,-0.89 1.07,-1.22 1.02,-1.22
  pour Bottom (isolate 0.406): -0.1,-0.3 -0.1,91.16 105.94,91.16 105.94,-1.02 -0.08,-1.02 -0.08,-0.36
HOT1
  Top 0.254: R50.2 37.88,65.04 37.58,65.04 36.32,66.29 36.32,68.9 R52.1 | 36.22,68.92 R52.1 | U$1.13 30.35,72.09 31.37,71.07 33.33,71.07 35.56,68.83 36.14,68.83 R52.1
LCD4
  Top 0.254: SV4.6 88.67,39.14 87.45,40.36 87.45,42.34 88.09,42.98 89.61,42.98 90.42,42.16 92.83,42.16 U$1.44
LCD5
  Top 0.254: 86.18,39.19 SV4.5 86.18,38.94 87.22,37.9 91.75,37.9 94.46,40.62 95.53,40.62 96.39,41.48 96.39,43.19 U$1.45
LCD6
  Top 0.254: SV4.8 94.89,41.68 U$1.46
LCD7
  Bottom 0.254: SV4.7 86.18,41.53 87.45,40.26 87.45,38.66 88.27,37.85 93.98,37.85 94.23,38.1 95.96,38.1 96.37,38.51 96.37,40.62 U$1.47
LCD_ENA
  Top 0.254: SV4.4 88.65,36.6 87.43,35.38 85.27,35.38 84.33,36.32 84.33,46.23 86.61,48.51 94.23,48.51 94.49,48.26 96.39,48.26 U$1.43
LCD_RS
  Top 0.254: SV4.3 85.57,36.6 84.84,37.34 84.84,45.97 86.87,48.01 92.2,48.01 93.22,46.99 U$1.42
MISO
  Bottom 0.254: SV5.2 88.57,51.61 87.22,52.96 85.55,52.96 84.78,52.2 68.91,52.2 67.74,53.37 65.88,53.37 U$1.MISO_ICSP
MOSI
  Bottom 0.254: 67.15,52.09 U$1.MOSI_ICSP 66.9,51.79 66.67,51.79 65.13,53.34 63.27,53.34 63.27,55.91 67.87,55.91 68.5,55.27 68.5,53.44 69.24,52.7 84.35,52.7 84.73,53.09 84.73,55.37 86.06,56.69 SV5.5
N$1
  Bottom 0.305: JP50.2 57.99,17.35 STEPSTICK-Y.MS2
N$2
  Top 0.254: R28.1 C57.1 R24.1 50.08,35.73 50.95,36.6 50.95,41.55 H17.1
N$3
  Top 0.254: H19.1 62.11,40.28 62.79,39.6 R33.1 | R33.1 | R33.1 R30.1 61.26,35.61 C61.1
N$4
  Top 3.81: U$2.2 19.62,85.94 P5.1
N$5
  Bottom 0.305: STEPSTICK-X.SLEEP STEPSTICK-X.RESET
N$6
  Bottom 0.254: U$1.28 95.15,64.77 96.37,63.55 97.99,63.55 99.31,62.23 JP62.1
N$7
  Bottom 0.254: U$1.32 95.25,59.69 96.52,58.42 98.3,58.42 99.31,57.4 100.58,57.4 101.09,56.9 101.09,55.12 101.6,54.61 JP63.1
N$8
  Bottom 1.27: J1.4 82.93,5.25 STEPSTICK-X.2B
N$9
  Top 0.61: U$13.1 43.94,86.31 | 43.94,87.66 35.36,87.66 35.36,82.04 | 35.36,82.04 35.36,81.56 | 35.36,81.56 43.94,81.56 43.94,81.1 | 43.94,81.1 35.36,81.1 35.36,81.56 | 35.36,82.04 42.32,82.04 42.32,81.69 41.27,81.69 41.27,82.42 35.84,82.42 35.84,82.53 35.66,82.53 35.66,83.29 36.09,83.29 36.09,82.83 36.5,82.83 36.5,82.73 35.64,82.73 35.64,85.67 35.84,85.67 35.84,87.2 42.55,87.2 42.55,87.27 42.04,87.27 42.04,86.61 36.09,86.61 36.09,86.36 36.27,86.36 36.27,86.06 36.55,86.06 36.55,86.31 43.94,86.31 | 43.94,86.31 43.94,87.66 | 43.94,87.66 45.8,87.66 45.8,81.1 45.44,81.1 | 43.94,81.1 45.44,81.1 | 45.44,81.1 45.44,81.53 45.39,81.53 45.39,87.25 45.21,87.25 45.21,87.17 44.96,87.17 44.96,84.2 44.7,84.2 44.7,84.33
  Top 3.81: P2.1 42.47,84.55 | 42.47,84.55 U$13.1 | 42.47,84.55 42.47,84.19 U$13.2
N$10
  Top 0.254: STEPSTICK-X.MS1 80.39,18.31 R2.2
  Bottom 0.305: JP55.2 76.25,16.56 STEPSTICK-X.MS1
N$11
  Bottom 0.305: JP56.2 79.55,17.32 STEPSTICK-X.MS2
N$12
  Bottom 0.305: JP57.2 82.88,18.11 STEPSTICK-X.MS3
N$13
  Bottom 1.27: J1.3 85.47,5.25 STEPSTICK-X.2A
N$14
  Bottom 1.27: J1.2 88.01,5.25 STEPSTICK-X.1B
N$15
  Bottom 1.27: J1.1 90.55,5.25 STEPSTICK-X.1A
N$16
  Top 0.254: C59.1 R32.1 56.53,35.96 | H18.1 56.53,35.96 | 56.53,35.96 56.53,35.78 R29.1
N$17  (via drill 1 pad 1.27)
  Top 1.016: L2.1 88.91,14.29 | C4.1 79.41,3.44 C3.+
  Top 1.27: 88.91,14.29 v88.92,14.28
  Bottom 1.016: v88.92,14.28 88.92,12.17 88.21,11.46 79.4,11.46 77.88,9.93 77.88,8.03 | STEPSTICK-X.VMOT 77.85,5.01 C3.+
  Bottom 1.27: 77.88,8.03 STEPSTICK-X.VMOT
N$18
  Bottom 0.254: U$1.36 95.12,54.49 96.27,53.34 99.82,53.34 100.84,52.32 100.84,49.28 JP64.1
N$19
  Top 0.254: R4.2 58.81,20.69 STEPSTICK-Y.MS1
  Bottom 0.305: JP49.2 54.66,16.56 STEPSTICK-Y.MS1
N$20
  Bottom 0.305: JP51.2 61.24,18.06 STEPSTICK-Y.MS3
N$21
  Bottom 0.305: JP47.2 36.47,17.3 STEPSTICK-Z1.MS2
N$22
  Bottom 0.305: STEPSTICK-Y.SLEEP STEPSTICK-Y.RESET
N$23
  Bottom 1.27: J2.4 61.34,4.94 STEPSTICK-Y.2B
N$24
  Bottom 1.27: J2.3 63.88,4.94 STEPSTICK-Y.2A
N$25
  Bottom 1.27: J2.2 66.42,4.94 STEPSTICK-Y.1B
N$26
  Bottom 1.27: J2.1 68.96,4.94 STEPSTICK-Y.1A
N$27  (via drill 1 pad 1.27)
  Top 1.016: L4.1 v67.21,14.25 | C9.1 57.49,3.39 C6.+
  Bottom 1.016: v67.21,14.25 67.21,12.32 66.34,11.46 57.58,11.46 56.26,10.13 STEPSTICK-Y.VMOT 56.26,4.64 C6.+
N$28
  Bottom 0.254: U$1.39 99.57,52.07 100.08,51.56 100.08,48.77 101.6,47.24 101.6,45.97 JP65.1
N$29
  Top 0.254: JP8.3 62.47,60.71 R16.2
N$30
  Top 0.254: R6.2 STEPSTICK-Z1.MS1
  Bottom 0.305: JP46.2 33.17,16.54 STEPSTICK-Z1.MS1
N$31
  Bottom 0.305: JP48.2 39.78,18.06 STEPSTICK-Z1.MS3
N$32
  Bottom 0.305: JP11.2 14.99,17.4 STEPSTICK-Z2.MS2
N$33
  Bottom 0.305: STEPSTICK-Z1.SLEEP STEPSTICK-Z1.RESET
N$34
  Bottom 1.27: J3.4 39.88,4.38 STEPSTICK-Z1.2B
N$35
  Bottom 1.27: J3.3 42.42,4.38 STEPSTICK-Z1.2A
N$36
  Bottom 1.27: J3.2 44.96,4.38 STEPSTICK-Z1.1B
N$37
  Bottom 1.27: J3.1 47.5,4.38 STEPSTICK-Z1.1A
N$38  (via drill 1 pad 1.27)
  Top 1.016: L6.1 v45.89,14.32 | C14.1 35.47,3.5 C8.+
  Top 1.27: v45.89,14.32 v45.9,14.33
  Bottom 1.016: v45.9,14.33 45.9,12.68 44.73,11.51 36.12,11.51 34.82,10.21 34.82,8.03 | STEPSTICK-Z1.VMOT 34.8,4.19 C8.+
  Bottom 1.27: 34.82,8.03 STEPSTICK-Z1.VMOT
N$39
  Bottom 0.254: JP66.1 U$1.49
N$40
  Top 0.254: JP10.3 R18.2
N$41
  Top 0.254: R8.2 STEPSTICK-Z2.MS1
  Bottom 0.305: JP9.2 11.68,16.64 STEPSTICK-Z2.MS1
N$42
  Bottom 0.305: JP13.2 18.29,18.16 STEPSTICK-Z2.MS3
N$43
  Bottom 0.254: JP67.1 U$1.51
N$44
  Bottom 0.305: STEPSTICK-Z2.SLEEP STEPSTICK-Z2.RESET
N$45
  Bottom 1.27: J4.4 18.29,3.92 STEPSTICK-Z2.2B
N$46
  Bottom 1.27: J4.3 20.83,3.92 STEPSTICK-Z2.2A
N$47
  Bottom 1.27: J4.2 23.37,3.92 STEPSTICK-Z2.1B
N$48
  Bottom 1.27: J4.1 25.91,3.92 STEPSTICK-Z2.1A
N$49  (via drill 1 pad 1.27)
  Top 1.016: L8.1 24.63,14.36 | C19.1 13.62,3.3 C10.+
  Top 1.27: 24.63,14.36 v24.64,14.35
  Bottom 1.016: v24.64,14.35 24.64,12.19 23.88,11.43 14.61,11.43 13.21,10.03 STEPSTICK-Z2.VMOT 13.21,3.7 C10.+
N$50
  Bottom 0.254: JP68.1 U$1.53
N$51
  Top 0.254: JP12.3 R20.2
N$52
  Top 0.254: U$1.A3 JP69.1
N$53
  Top 0.254: U$1.A4 JP70.1
N$54
  Top 0.254: U$1.A11 JP71.1
N$55
  Bottom 0.254: U$1.23 99.57,72.39 102.11,74.93 JP72.1
N$56
  Bottom 0.254: U$1.24 95.12,69.97 96.27,71.12 100.84,71.12 102.11,72.39 JP73.1
N$57  (via drill 0.6)
  other vias: 25.65,67.82
N$58  (via drill 0.6)
  other vias: 26.92,67.82
N$59  (via drill 0.6)
  other vias: 28.19,67.82
N$60  (via drill 0.6)
  other vias: 28.19,66.55
N$61  (via drill 0.6)
  other vias: 26.92,66.55
N$62  (via drill 0.6)
  other vias: 25.65,66.55
N$63  (via drill 0.6)
  other vias: 25.65,65.28
N$64  (via drill 0.6)
  other vias: 26.92,65.28
N$65  (via drill 0.6)
  other vias: 28.19,65.28
N$66  (via drill 0.6)
  other vias: 28.19,64.01
N$67  (via drill 0.6)
  other vias: 26.92,64.01
N$68  (via drill 0.6)
  other vias: 25.65,64.01
N$69  (via drill 0.6)
  other vias: 24.38,64.01
N$70  (via drill 0.6)
  other vias: 24.38,65.28
N$71  (via drill 0.6)
  other vias: 24.38,66.55
N$72  (via drill 0.6)
  other vias: 24.38,67.82
N$73  (via drill 0.6)
  Top 0.254: R34.1 R31.1 64.96,36.9 64.52,37.34 64.52,40.64 66.04,42.16 | 66.04,42.16 66.04,43.6 C63.1 | 32.08,55.93 v32.18,56.03 30.23,57.99 THERMISTOR.1 | v66.75,41.96 66.24,41.96 66.04,42.16
  Bottom 0.254: v32.18,56.03 58.95,56.03 59.84,55.14 59.84,46.1 60.83,45.11 64.31,45.11 v66.75,41.96
N$84
  Top 0.254: 94.49,85.02 LED5.A 92.64,83.21 R49.1
N$86
  Top 0.406: 14.53,51.24 IC5.4 14.59,51.28
  Top 0.61: 14.53,51.24 14.53,48.62 R22.2 14.48,46.2 C68.1 R23.1
N$88
  Top 0.254: Q2.1 32.92,53.47 34.39,54.94 34.39,56.42 R37.1
  Top 0.305: R27.1 R37.1
N$89
  Top 0.61: H14.2 25.2,47.34 LED2.C 25.35,48.21 26.92,49.78 27.69,49.78 28.45,50.55 28.45,51.05 Q2.3
N$90
  Top 0.254: R38.2 30.35,42.32 29.23,43.43 28.19,43.43 26.92,44.7 26.92,46.23 27.45,46.75 LED2.A
N$91
  Top 0.254: R36.1 R35.1 39.35,54.74 39.14,54.53 Q1.1
N$95
  Top 0.254: R52.2 39.22,70.86 39.78,70.31 39.78,69.71 LED6.A
N$99
  Top 1.27: D3.A 4.58,61.06 1.65,61.06 1.65,45.21 L15.2
N$100
  Top 0.61: H13.2 32.94,47.29 LED1.C 33.15,47.88 35.05,49.78 37.57,49.78 38.25,50.47 38.25,51.29 Q1.3
N$101
  Top 0.254: R26.2 38,42.32 36.88,43.43 36.07,43.43 34.8,44.7 34.8,46.23 35.25,46.68 LED1.A
N$102
  Top 0.254: R41.1 44.3,56.42 R40.1
  Top 0.305: R41.1 46.77,54.99 Q3.1
N$103
  Top 0.61: H15.2 40.45,47.31 LED3.C 40.63,47.99 42.42,49.78 43.94,49.78 44.45,50.29 44.45,51.32 Q3.3
N$104
  Top 0.254: R43.2 45.62,41.53 45.62,42.37 44.55,43.43 43.69,43.43 42.16,44.96 42.16,45.97 42.73,46.54 LED3.A
N$109
  Top 0.61: U$13.3 53.62,86.01 53.62,86.77 | 53.62,87.63 62.69,87.63 62.69,81.89 | 62.69,81.89 62.69,81.18 | 62.69,81.18 53.67,81.18 | 53.29,81.18 53.67,81.18 | 53.67,81.18 53.67,81.13 62.69,81.13 62.69,81.18 | 62.69,81.89 62.48,81.89 62.48,81.64 55.12,81.64 55.12,81.33 55.7,81.33 55.7,81.94 62.2,81.94 62.2,82.02 62.38,82.02 62.38,83.13 61.87,83.13 61.87,82.75 61.9,82.75 61.9,82.37 56.16,82.37 56.16,82.14 56.34,82.14 56.34,82.58 61.52,82.58 61.52,82.7 62.33,82.7 62.33,87.27 55.04,87.27 55.04,87.4 55.55,87.4 55.55,86.74 61.47,86.74 61.47,86.49 61.98,86.49 61.98,86.31 61.9,86.31 61.9,86.77 53.62,86.77 | 53.62,86.77 53.62,87.63 | 53.62,87.63 51.82,87.63 51.82,81.13 53.75,81.13 53.75,81.15 52.15,81.15 52.15,81.43 52.09,81.43 52.09,84.96 52.45,84.96 52.45,84.18 52.17,84.18 52.17,87.35 53.85,87.35 53.85,86.36
  Top 3.81: P3.1 55.58,84.64 | 55.58,84.64 U$13.4 | 55.58,84.64 55.03,84.64 U$13.3
N$110  (via drill 0.6)
  Top 0.254: R48.1 85.93,86.16 v85.19,86.89 82.26,83.96 R47.1
  Top 0.61: 86.83,86.11 R48.1
  Bottom 0.254: v85.19,86.89 FET2.G
N$111  (via drill 0.6)  (15 unrouted)
  Bottom 0.61: P3.2 70.72,84.64 72.95,86.87 72.52,86.87 72.34,87.05 | 72.34,87.05 72.03,87.05 | 72.03,87.05 64.34,87.05 64.34,83.54 | 64.34,83.54 64.34,82.55 | 64.34,82.55 73.66,82.55 73.66,82.91 72.49,82.91 72.49,82.22 64.34,82.22 64.34,82.55 | 64.34,83.54 64.8,83.54 64.8,82.93 65.28,82.93 65.28,82.88 64.67,82.88 64.67,86.67 65.61,86.67 65.61,86.69 65.08,86.69 65.08,86.31 65.99,86.31 65.99,86.56 72.31,86.56 72.31,86.54 72.03,86.54 72.03,87.05 | 72.34,87.05 78.03,87.05 78.03,86.77
  Bottom 3.81: FET2.D 66.02,84.61 P3.2
  other vias: 77.22,86.36 77.24,84.61 77.24,82.65 75.18,82.65 73.13,82.65 75.21,84.61 75.18,86.36 73.15,86.36 73.18,84.61 71.12,86.36 71.12,84.61 69.09,86.36 71.09,82.65 69.09,82.65 69.09,84.61
N$114
  Top 0.254: 33.5,63.51 FET1.G | R51.1 36,64.38 R50.1 35.09,63.51 33.53,63.51
  Top 0.305: 33.53,63.51 FET1.G
N$115
  Top 3.81: FET1.D 22.02,65.76 16.36,71.42 6.21,71.42 P4.2
N$117
  Top 3.81: P4.1 11.41,76.44 14.22,79.25 14.22,79.43 U$2.1
N$121
  Top 0.254: R39.1 LED7.A
N$122
  Top 2.54: P7.1 5.2,16.38 3.35,14.53 3.35,10.43 U$3.2
N$129
  Top 0.305: JP7.3 20.82,53.14 20.42,53.54 9.86,53.54 9.5,53.19 9.5,51.32 IC5.1
  Top 0.406: IC5.1 9.7,51.28 9.73,51.31
  Top 1.422: C65.+ 9.45,52.25 9.45,50.39 9.46,50.39 IC5.1
  Top 1.676: D3.C C65.+
N$130
  Top 1.27: IC5.2 11.2,51.28 D4.C | 11.4,44.85 11.4,41.78 13.34,39.85
  Top 1.676: L19.1 13.34,39.85 | 11.4,44.85 D4.C
NTC1
  Top 0.254: U$1.A0 51.71,26.67 50.06,28.32 50.06,32.67 R24.2
NTC2
  Top 0.254: U$1.A1 54.48,27.68 55.17,28.37 55.17,32.68 R32.2
NTC3
  Top 0.254: U$1.A2 57.02,29.84 57.91,30.73 61.47,30.73 62.74,32 62.74,32.65 R33.2
NTC4
  Top 0.254: U$1.A5 64.64,28.31 66.04,29.72 R34.2
PSON
  Bottom 0.254: 95.12,49.51 U$1.40 95.25,49.53 96.52,50.8 98.81,50.8 99.31,50.29 99.31,48.51 101.09,46.74 101.09,43.94 JP27.1
PWM1
  Top 0.254: U$1.5 JP25.1
PWM2
  Top 0.254: U$1.6 JP20.1
PWM3
  Top 0.254: JP19.1
  Bottom 0.254: JP19.1
RESET  (via drill 0.6)
  Top 0.254: 86.23,59.23 SV5.7 86.13,59.18 84.84,59.18 | v74.14,49.2 74.17,49.23 RESET.1 75.61,51.99 79.25,55.63 81.28,55.63 84.84,59.18 | H21.2 91.55,67.17 87.63,63.25 85.6,63.25 84.58,62.23 84.58,59.44 84.84,59.18
  Bottom 0.254: v74.14,49.2 74.14,50.83 73.97,51 68.91,51 68.58,50.67 68.58,48.9 67.82,48.13 66.03,48.13 U$1.RESET_ICSP
RX0
  Top 0.254: U$1.RX0 JP16.1
RX1
  Bottom 0.254: JP18.1 U$1.RX1
SCK
  Bottom 0.254: SV5.1 68.56,51.61 67.82,50.88 65.83,50.88 U$1.SCK_ICSP
SCL
  Top 0.254: IC2.6 78.58,64.15 79.63,65.2 79.63,67.03 80.39,67.79 86.11,67.79 87.53,69.22 H16.4
  Bottom 0.254: U$1.SCL 87.5,70.95 H16.4
SCL1
  Top 0.254: U$1.SCL1 JP6.1
  Bottom 0.254: JP6.1
SDA  (1 unrouted)
  Top 0.254: IC2.5 76.7,65.48 78.64,65.48 78.92,65.76 78.92,67.46 79.81,68.35 84.1,68.35 84.96,69.22 84.96,70.89 H16.3
  Bottom 0.254: 84.99,74.9 H16.3
SDA1
  Top 0.254: U$1.SDA1 JP14.1
  Bottom 0.254: JP14.1
SUPP1
  Top 0.61: C67.+ 3.66,35.37 3.66,35.99 17.63,35.99 | 17.63,35.99 19.38,35.99 | 19.38,35.99 19.38,31.9 3.63,31.9 3.63,35.81 4.06,35.81 4.06,32.33 18.85,32.33 | 19.15,32.33 18.85,32.33 | 18.85,32.33 18.85,35.48 4.65,35.48 4.65,32.69 18.34,32.69 18.34,35.05 5.11,35.05 5.11,33.25 18.52,33.25 18.52,34.77 5.59,34.77 5.59,34.24 | 5.59,34.24 5.59,33.81 18.64,33.81 L17.1 | 5.59,34.24 17.12,34.24 | 17.12,34.24 18.62,34.24 18.62,34.31 17.78,34.31 17.78,34.8 16.36,36.22 R23.2 C68.2 | 17.12,34.24 17.12,35.48 17.63,35.99 | 19.38,35.99 19.96,35.99 19.96,31.93 18.52,31.93 18.52,32.16 17.53,32.16 17.53,33.38
  Top 1.676: C67.+ 8.22,35.37 9.98,33.6 13.14,33.6 L19.2
TX0
  Top 0.254: U$1.TX0 JP15.1
TX1
  Bottom 0.254: U$1.TX1 JP17.1
X-DIR
  Top 0.254: STEPSTICK-X.DIR 95.63,25.68 100.08,30.12 100.08,75.74 99.03,76.78 99.03,78.05 98.32,78.77 89.71,78.77 88.39,77.44 75.62,77.44 74.75,76.58 74.75,74.97 U$1.TX2
X-ENA
  Top 0.254: STEPSTICK-X.ENABLE 77.85,18.21 R3.2 77.83,22.77 76.1,24.51 74.45,24.51 73.53,25.43 73.53,28.07 74.68,29.21 77.75,29.21 81.84,33.3 81.84,43.13 81.05,43.92 81.05,45.24 84.84,49.02 84.84,54.79 85.47,55.42 86.97,55.42 87.45,55.91 87.45,57.43 87.94,57.91 89.41,57.91 92.46,60.96 95.71,60.96 96.39,61.65 96.39,71.11 U$1.22
X-MIN  (via drill 0.6)
  Top 0.254: 60.36,56.81 v60.38,56.79 62.18,56.79 62.46,57.07 62.46,57.1 62.51,57.15 63.93,57.15 64.41,57.63 64.41,58.44 C51.2 R16.1
  Bottom 0.254: v60.38,56.79 60.38,46.3 60.96,45.72 78.23,45.72 81.28,48.77 91.81,48.77 U$1.38
X-STP
  Top 0.254: U$1.RX2 77.29,74.97 77.29,76.45 77.8,76.96 88.16,76.96 88.95,76.17 98.45,76.17 99.59,75.03 99.59,30.33 95.07,25.81 95.07,22.68 STEPSTICK-X.STP
Y-DIR  (via drill 0.6)
  Top 0.254: STEPSTICK-Y.DIR 74.04,22.45 72.95,23.55 71.58,23.55 71.07,24.05 71.07,27.86 70.21,28.73 69.52,28.73 68.91,29.34 68.91,44.25 72.11,47.45 72.11,69.16 v72.8,69.85 | 57,74.95 U$1.3 57.05,74.96
  Bottom 0.254: 72.8,69.98 v72.8,69.85 70.26,69.85 68.17,71.93 58.62,71.93 57.15,73.41 57.15,74.8 U$1.3
Y-ENA
  Top 0.254: R1.2 STEPSTICK-Y.ENABLE | STEPSTICK-Y.ENABLE | STEPSTICK-Y.ENABLE 56.26,21.84 57.02,22.61 69.52,22.61 70.21,21.92 70.21,19.61 71.09,18.72 74.42,18.72 75.23,19.53 75.23,22.99 73.05,25.17 73.05,28.35 74.42,29.72 77.47,29.72 81.28,33.53 81.28,42.93 80.52,43.69 80.52,45.47 84.33,49.28 84.33,56.77 85.52,57.96 86.77,57.96 87.45,58.65 87.45,60.1 87.86,60.5 91.21,60.5 92.3,61.59 93.42,61.59 93.85,62.03 93.85,66.05 U$1.26 95.09,67.28
Y-MIN  (via drill 0.6)
  Top 0.254: C49.2 66.8,62.23 | 66.8,62.23 66.8,62.48 66.04,63.25 R18.1 | v66.02,62.05 66.62,62.05 66.8,62.23
  Bottom 0.254: U$1.34 93.88,55.91 93.88,51.77 91.39,49.28 81.03,49.28 78,46.25 61.27,46.25 60.94,46.58 60.94,56.08 62.33,57.48 65.86,57.48 66.47,58.09 66.47,61.59 v66.02,62.05
Y-STP  (via drill 0.6)
  Top 0.254: 59.54,74.91 U$1.2 59.46,74.83 | STEPSTICK-Y.STP 71.48,20.73 71.48,22.4 68.4,25.48 68.4,44.45 71.63,47.68 71.63,70.79 72.29,71.45 72.29,72.06 71.45,72.9 v68.73,72.9
  Bottom 0.254: v68.73,72.9 60.1,72.9 59.51,73.48 59.51,74.89 U$1.2
Z-DIR
  Bottom 0.254: STEPSTICK-Z1.DIR 52.58,21.49 54.13,23.04 75.26,23.04 77.29,25.07 77.29,26.63 U$1.A9
Z-ENA  (via drill 0.6)
  Top 0.254: R5.2 STEPSTICK-Z1.ENABLE 34.8,22.3 35.43,22.94 56.44,22.94 56.64,23.14 64.69,23.14 65.94,24.38 65.94,28.3 66.57,28.93 67.54,28.93 67.82,29.21 67.82,44.53 71.12,47.83 71.12,71.68 v71.2,71.75 | 72.21,74.97 U$1.RX3
  Bottom 0.254: 72.21,74.89 U$1.RX3 72.24,74.91 72.24,73.15 71.2,72.11 v71.2,71.75
Z-MIN  (via drill 0.6)
  Top 0.254: C32.2 64.37,65.81 R20.1 65.42,64.77 v66.29,64.77
  Bottom 0.254: U$1.30 93.4,60.51 93.4,52.12 91.06,49.78 80.77,49.78 77.75,46.76 61.7,46.76 61.52,46.94 61.52,55.75 62.61,56.84 65.99,56.84 67.06,57.91 67.06,64.01 v66.29,64.77
Z-STP
  Bottom 0.254: STEPSTICK-Z1.STP 50.04,20.73 53.01,23.7 74.57,23.7 76.05,25.17 76.05,28.35 76.63,28.93 79.4,28.93 79.93,28.4 79.93,26.73 U$1.A10
(copper drawn outside any net)
  shapes: Bottom area x1, Top area x2

## Text on the board
tPlace: 23052016-1301
tNames: HOT PWR | - | - | BED PWR | - | + | + | + | BED | FUSE 20A | FUSE 10A | LED5 | + | GND | +5V | +5V | HOTEND | FAN0 | LED6 | MINIMUM | ENDSTOP | - | Z | Y | 1-2 - 24V / 2-3 - 12V | X | + | S | - | C46 | T3 | EXP1 | C47 | RESET | DUE3DOM | LED2 | LED1 | LED3 | MINI | T0 | T1 | T2 | - | + | - | + | - | + | rev. 1.0 | due freedom | Designed for | FAN2 | FAN1 | FAN3 | EXP2 | +12V | GND | POWER | 12-24VDC | +3V3 | GND | www.due3dom.pl | +3V3 | - | + | GND | Fuse 10A | E-STEPPER | Z-STEPPER | Y-STEPPER | X-STEPPER